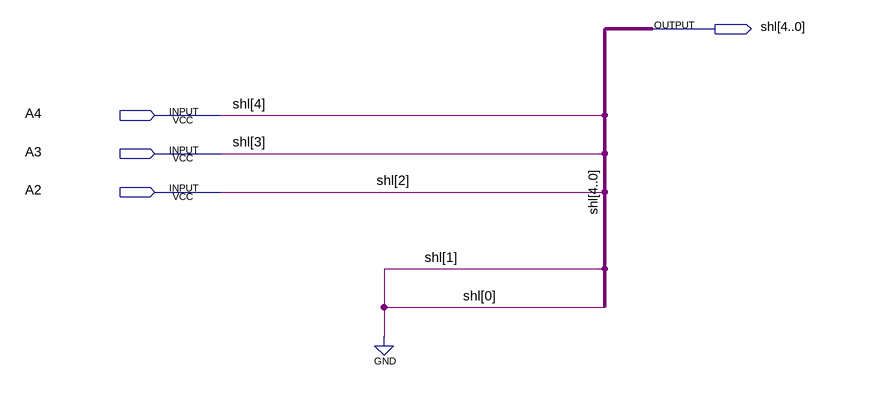
[diagram p0: schematic sheet]
// Quartus schematic ShL2.bdf as structural Verilog: 0 symbols, 4 pins
module ShL2 (
  input  A4,
  input  A3,
  input  A2,
  output [4:0] shl
);


  assign shl = {A4, A3, A2, 2'b00};
endmodule
